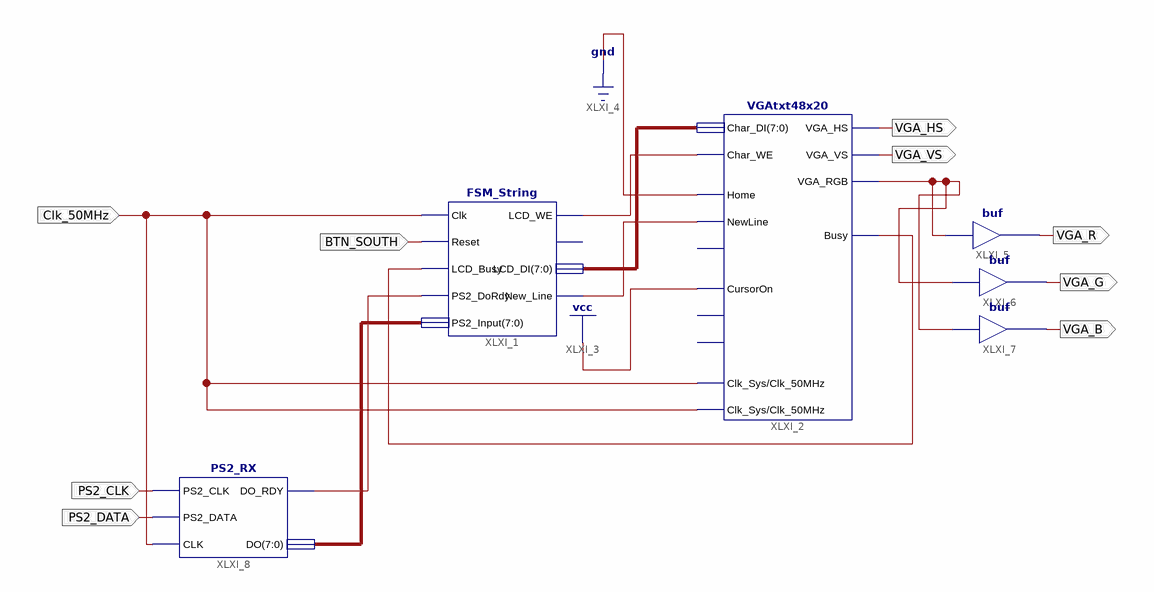
[diagram p0: schematic sheet 1]
// Xilinx ISE schematic TYPE_LEARNER_SCH.sch (spartan3e) as structural Verilog: 6 symbols, 9 ports
module TYPE_LEARNER_SCH (
  input  BTN_SOUTH,
  input  Clk_50MHz,
  input  PS2_CLK,
  input  PS2_DATA,
  output VGA_HS,
  output VGA_VS,
  output VGA_R,
  output VGA_G,
  output VGA_B
);

  wire XLXN_2, XLXN_8, XLXN_9, XLXN_25, XLXN_27;
  wire [7:0] XLXN_1, XLXN_26;

  FSM_String XLXI_1 (
    .Clk(Clk_50MHz), .Reset(BTN_SOUTH), .LCD_Busy(XLXN_8), .PS2_DoRdy(XLXN_25), .PS2_Input(XLXN_26),
    .LCD_WE(XLXN_2), .New_Line(XLXN_27), .LCD_DI(XLXN_1));  // open: LCD_DnI
  VGAtxt48x20 XLXI_2 (
    .Char_DI(XLXN_1), .Home(1'b0), .NewLine(XLXN_27), .Clk_Sys(Clk_50MHz), .Clk_50MHz(Clk_50MHz),
    .CursorOn(1'b1), .Busy(XLXN_8), .VGA_HS(VGA_HS), .VGA_VS(VGA_VS), .VGA_RGB(XLXN_9), .Char_WE(XLXN_2));  // open: Goto00, ScrollEn, ScrollClear
  buf XLXI_5 (VGA_R, XLXN_9);
  buf XLXI_6 (VGA_G, XLXN_9);
  buf XLXI_7 (VGA_B, XLXN_9);
  PS2_RX XLXI_8 (.PS2_CLK(PS2_CLK), .PS2_DATA(PS2_DATA), .CLK(Clk_50MHz), .DO_RDY(XLXN_25), .DO(XLXN_26));
endmodule
